# EAGLE design W070C (EAGLE 6.6.0)
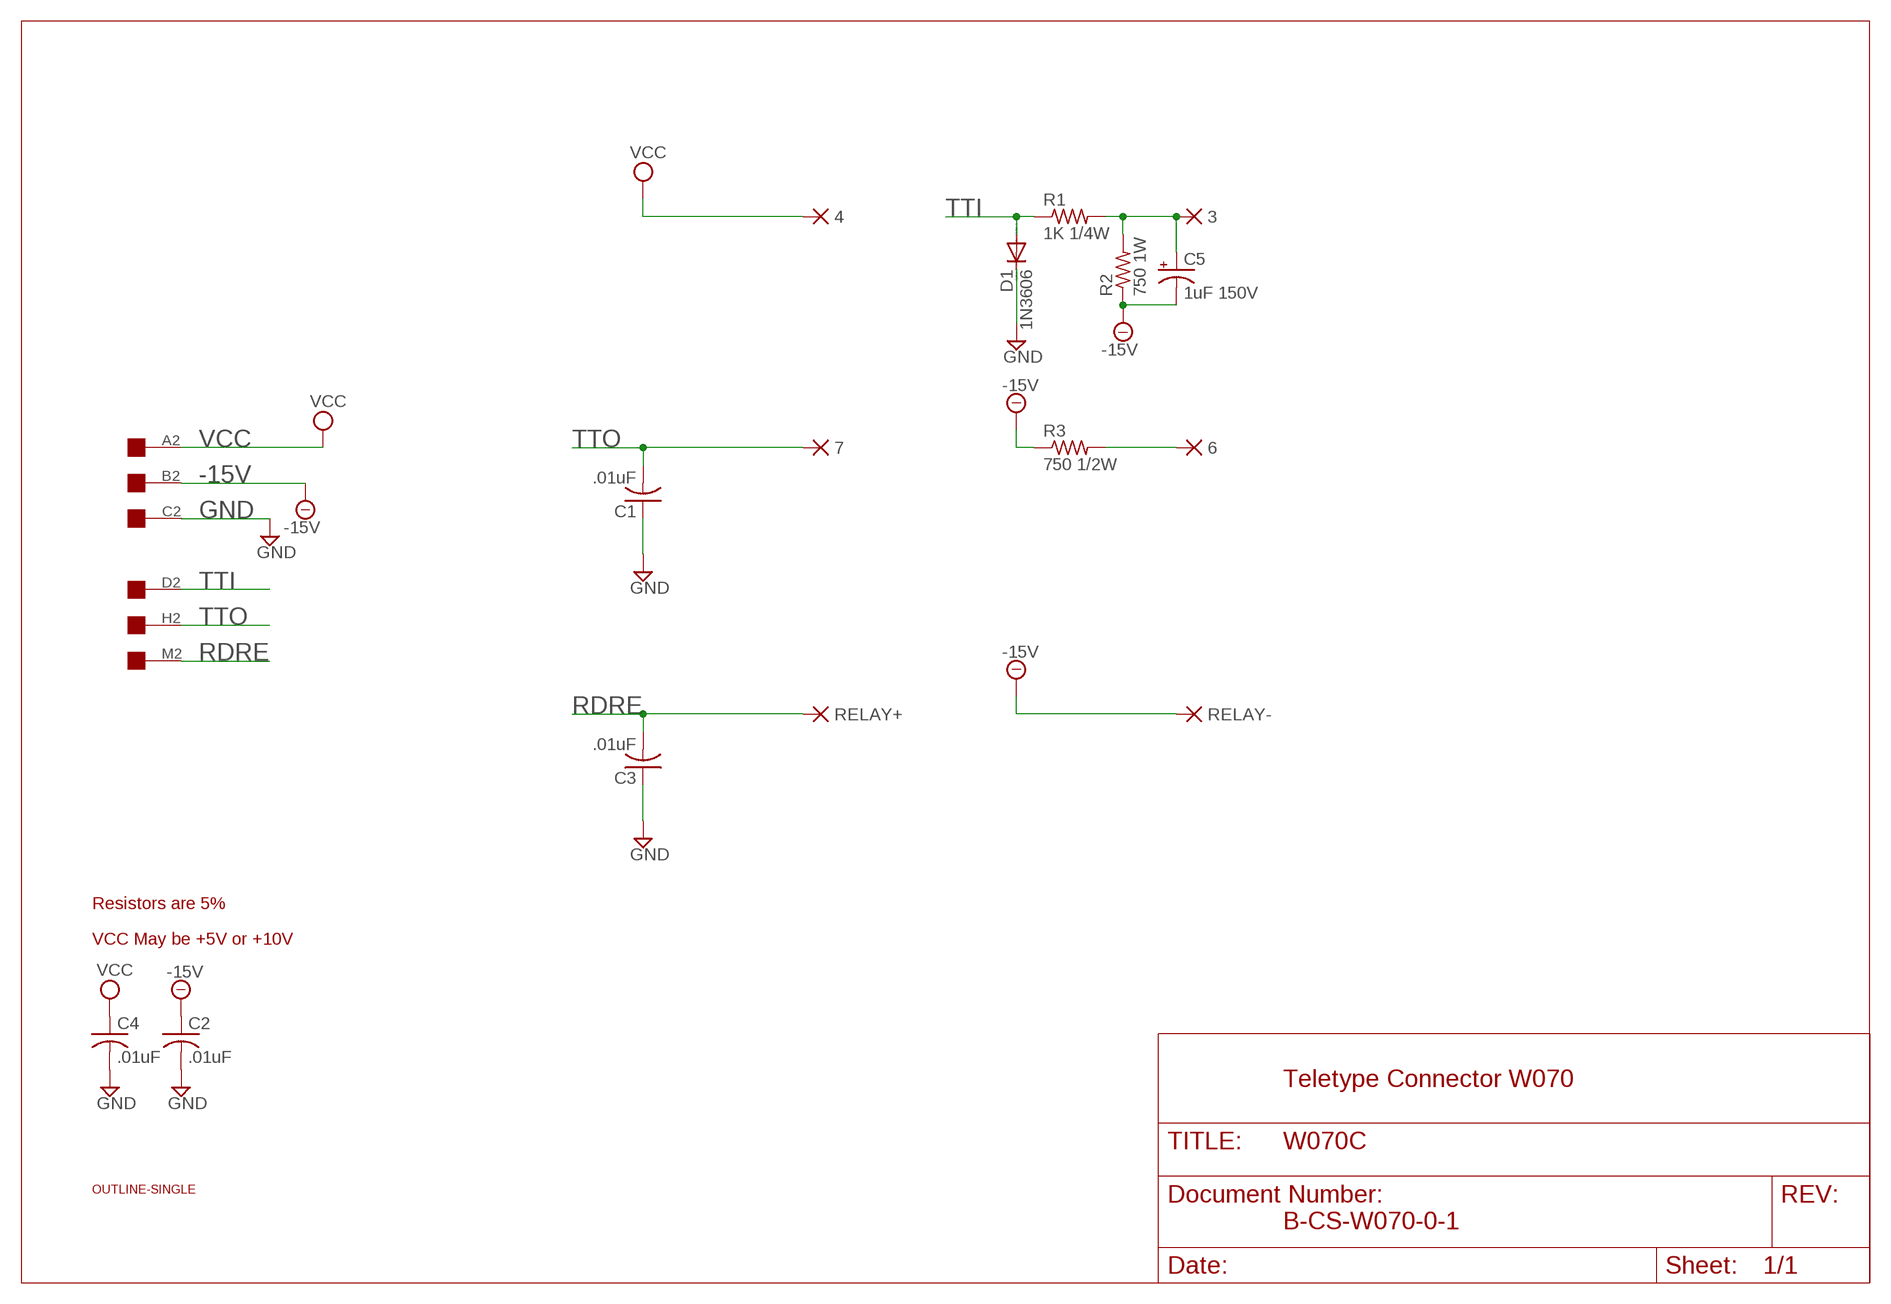
[diagram p0: schematic, sheet 1]

## Parts
3  PAD-0465  [0465]
4  PAD-0465  [0465]
6  PAD-0465  [0465]
7  PAD-0465  [0465]
C1  .01uF  C-US050-025X075  [C050-025X075]
C2  .01uF  C-US050-025X075  [C050-025X075]
C3  .01uF  C-US050-025X075  [C050-025X075]
C4  .01uF  C-US050-025X075  [C050-025X075]
C5  1uF 150V  CPOL-USE25-9AXIAL  [E25-9]
D1  1N3606  1N4148DO35-10  [DO35-10]
EDGE  EDGE-1  [EDGE-CON1]
R1  1K 1/4W  R-US_0207/10  [0207/10]
R2  750 1W  R-US_0411/12  [0411/12]
R3  750 1/2W  R-US_0309/12  [0309/12]
RELAY+  PAD-0465  [0465]
RELAY-  PAD-0465  [0465]
U$1  OUTLINE-SINGLE  [SINGLE]

## Nets
-15V: C2.1 C5.- EDGE.B2 R2.1 R3.1 RELAY-.P$1(P)
GND: C1.1 C2.2 C3.1 C4.2 D1.C EDGE.C2
N$1: 6.P$1(P) R3.2
N$2: 3.P$1(P) C5.+ R1.2 R2.2
RDRE: C3.2 EDGE.M2 RELAY+.P$1(P)
TTI: D1.A EDGE.D2 R1.1
TTO: 7.P$1(P) C1.2 EDGE.H2
VCC: 4.P$1(P) C4.1 EDGE.A2
Unconnected: EDGE.E2 EDGE.F2 EDGE.J2 EDGE.K2 EDGE.L2 EDGE.N2 EDGE.P2 EDGE.R2 EDGE.S2 EDGE.T2 EDGE.U2 EDGE.V2

## Notes on the sheet
- Resistors are 5%
- VCC May be +5V or +10V
- Teletype Connector W070
- B-CS-W070-0-1

## Library data of the parts
3 4 6 7 RELAY+ RELAY- = dec-con:PAD: WIRE PAD Standard US Drill Sizes
C1-C4 = rcl:C-US: CAPACITOR, American symbol
C5 = rcl:CPOL-US: POLARIZED CAPACITOR, American symbol
D1 = diode:1N4148: DIODE high speed (Philips)
EDGE = dec-con:EDGE-1: Single-Sided DEC Edge Connector -- (side 2)
R1-R3 = rcl:R-US_: RESISTOR, American symbol
U$1 = dec-con:OUTLINE-*: Board outlines for DEC boards.

## Board
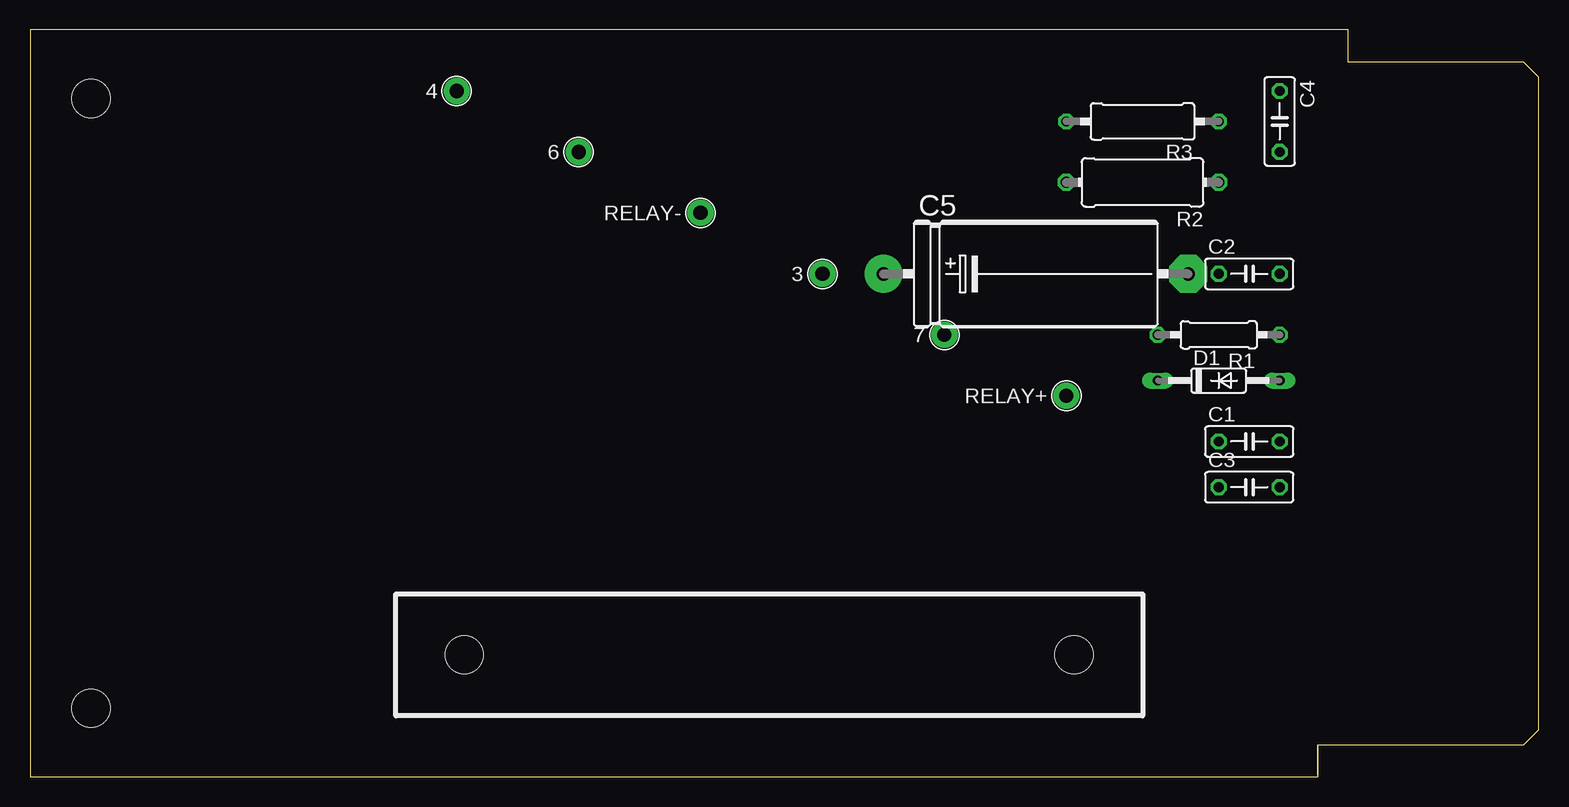
[diagram p1: board, top side]
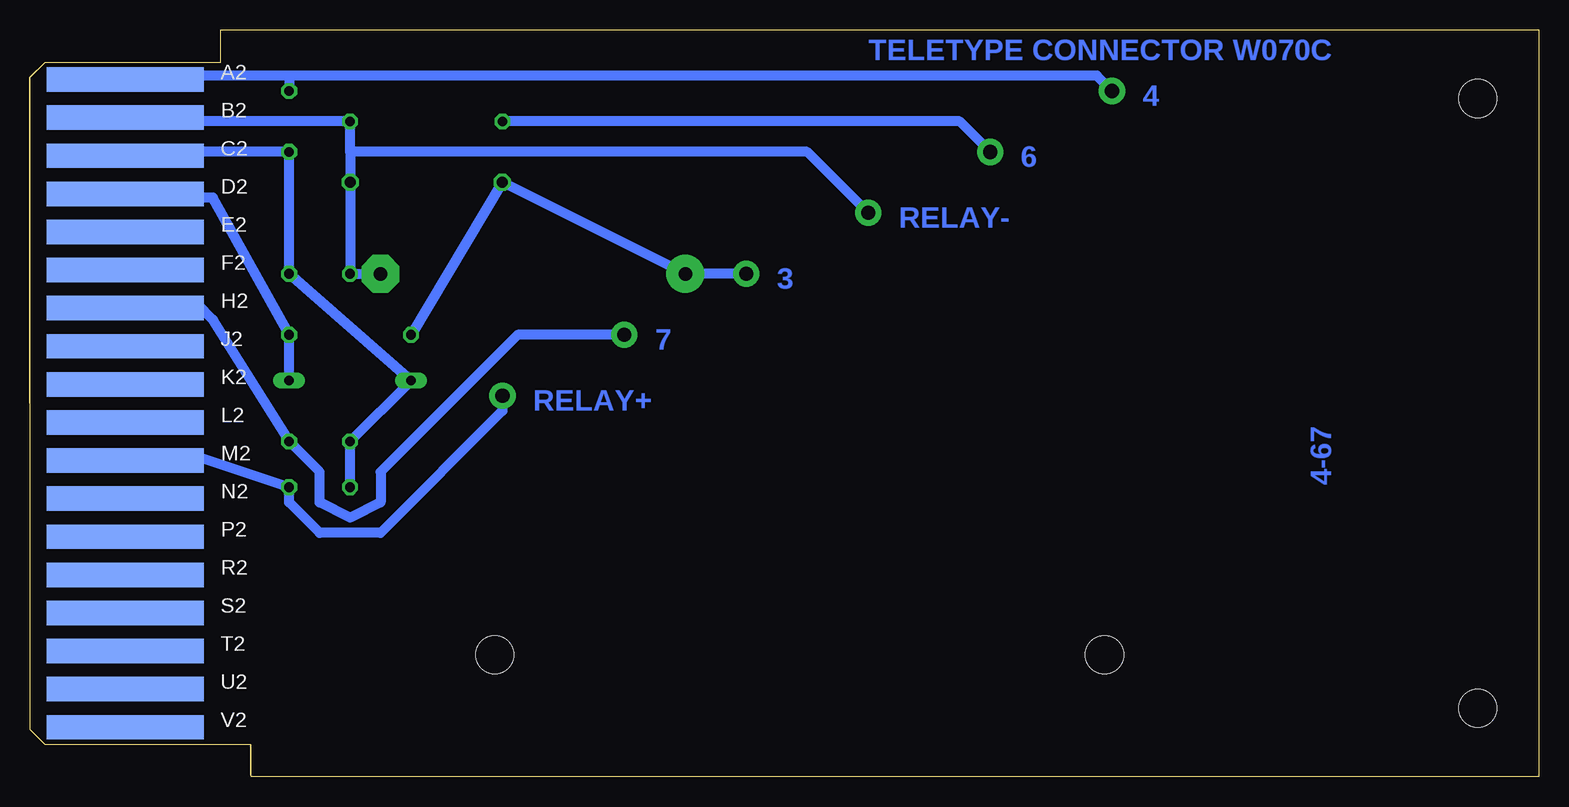
[diagram p2: board, bottom side, seen from below]

Size 125.73 x 62.23 mm. Coordinates in mm from the lower left corner, seen from the top.
Copper layers (1+16): Top 0.035mm / dielectric 1.5mm / Bottom 0.035mm
Design rules "16mils": minimum track width 16mil, minimum drill 32mil, track to track 15mil, track to pad 10mil, pad to pad 10mil, via to via 10mil, smd to smd 10mil, copper to edge 13mil, drill to drill 10mil, minimum pad ring 10mil, minimum via ring 8mil, stop-mask expansion 0mil, vias tented up to drill 0mil, thermal gap 10mil
Holes 3.17 mm at 36.2,10.16 87,10.16

### Footprints (pad centres in the part's own frame; a part is rotated, then mirrored left to right if it is on the bottom)
0465 = drill 1.181 pad 2.184: P$1 0,0
C050-025X075 = drill 0.813 octagon: 1 -2.54,0; 2 2.54,0
E25-9 = drill 1.118 pad 3.15: + -12.7,0 | drill 1.118 pad 3.15 octagon: - 12.7,0
DO35-10 = drill 0.813 long: A 5.08,0; C -5.08,0
EDGE-CON1 = smd 13.106 x 2.032 bottom: A2 7.938,4.128; B2 7.938,7.303; C2 7.938,10.477; D2 7.938,13.652; E2 7.938,16.828; F2 7.938,20.003; H2 7.938,23.177; J2 7.938,26.352; K2 7.938,29.527; L2 7.938,32.703; M2 7.938,35.877; N2 7.938,39.053; P2 7.938,42.227; R2 7.938,45.403; S2 7.938,48.578; T2 7.938,51.752; U2 7.938,54.928; V2 7.938,58.102
0207/10 = drill 0.813 octagon: 1 -5.08,0; 2 5.08,0
0411/12 = drill 0.914 octagon: 1 -6.35,0; 2 6.35,0
0309/12 = drill 0.813 octagon: 1 -6.35,0; 2 6.35,0
SINGLE = hole 3.175: 120.65,56.515; 120.65,5.715

### Placement (x,y rotation side)
3  66.04,41.91 180 top
4  35.56,57.15 180 top
6  45.72,52.07 180 top
7  76.2,36.83 180 top
C1  101.6,27.94 0 top
C2  101.6,41.91 0 top
C3  101.6,24.13 0 top
C4  104.14,54.61 270 top
C5  83.82,41.91 0 top
D1  99.06,33.02 0 top
EDGE  125.73,62.23 180 top
R1  99.06,36.83 180 top
R2  92.71,49.53 180 top
R3  92.71,54.61 180 top
RELAY+  86.36,31.75 180 top
RELAY-  55.88,46.99 180 top
U$1  125.73,62.23 180 top

### Tracks (layer width: path | path; a pad name or v marks a point on that pad's centre or on a via)
-15V
  Bottom 0.813: EDGE.B2 117.13,54.9 116.84,54.61 R3.1 99.06,52.07 | 99.06,52.07 R2.1 C2.1 C5.- | RELAY-.P$1 60.96,52.07 99.06,52.07
GND
  Bottom 0.813: EDGE.C2 117.17,51.74 116.84,52.07 C4.2 C2.2 D1.C C1.1 C3.1
N$1
  Bottom 0.813: 6.P$1 48.26,54.61 R3.2
N$2
  Bottom 0.813: 3.P$1 C5.+ R2.2 R1.2
RDRE
  Bottom 0.813: EDGE.M2 116.84,26.67 111.76,26.67 C3.2 104.14,22.86 101.6,20.32 96.52,20.32 86.36,30.48 RELAY+.P$1
TTI
  Bottom 0.813: EDGE.D2 116.84,48.26 110.49,48.26 R1.1 D1.A
TTO
  Bottom 0.813: EDGE.H2 116.84,39.37 111.76,39.37 110.49,38.1 C1.2 101.6,25.4 101.6,22.86 99.06,21.59 96.52,22.86 96.52,25.4 85.09,36.83 7.P$1
VCC
  Bottom 0.813: EDGE.A2 116.84,58.04 116.84,58.42 104.14,58.42 | 104.14,58.42 36.83,58.42 4.P$1 | 104.14,58.42 C4.1

### Text on the board
Bottom: TELETYPE CONNECTOR W070C | 4 | 6 | RELAY- | 3 | 7 | RELAY+ | 4-67